# EAGLE design MakePython NRF52840 V1.1 (EAGLE 6.1)
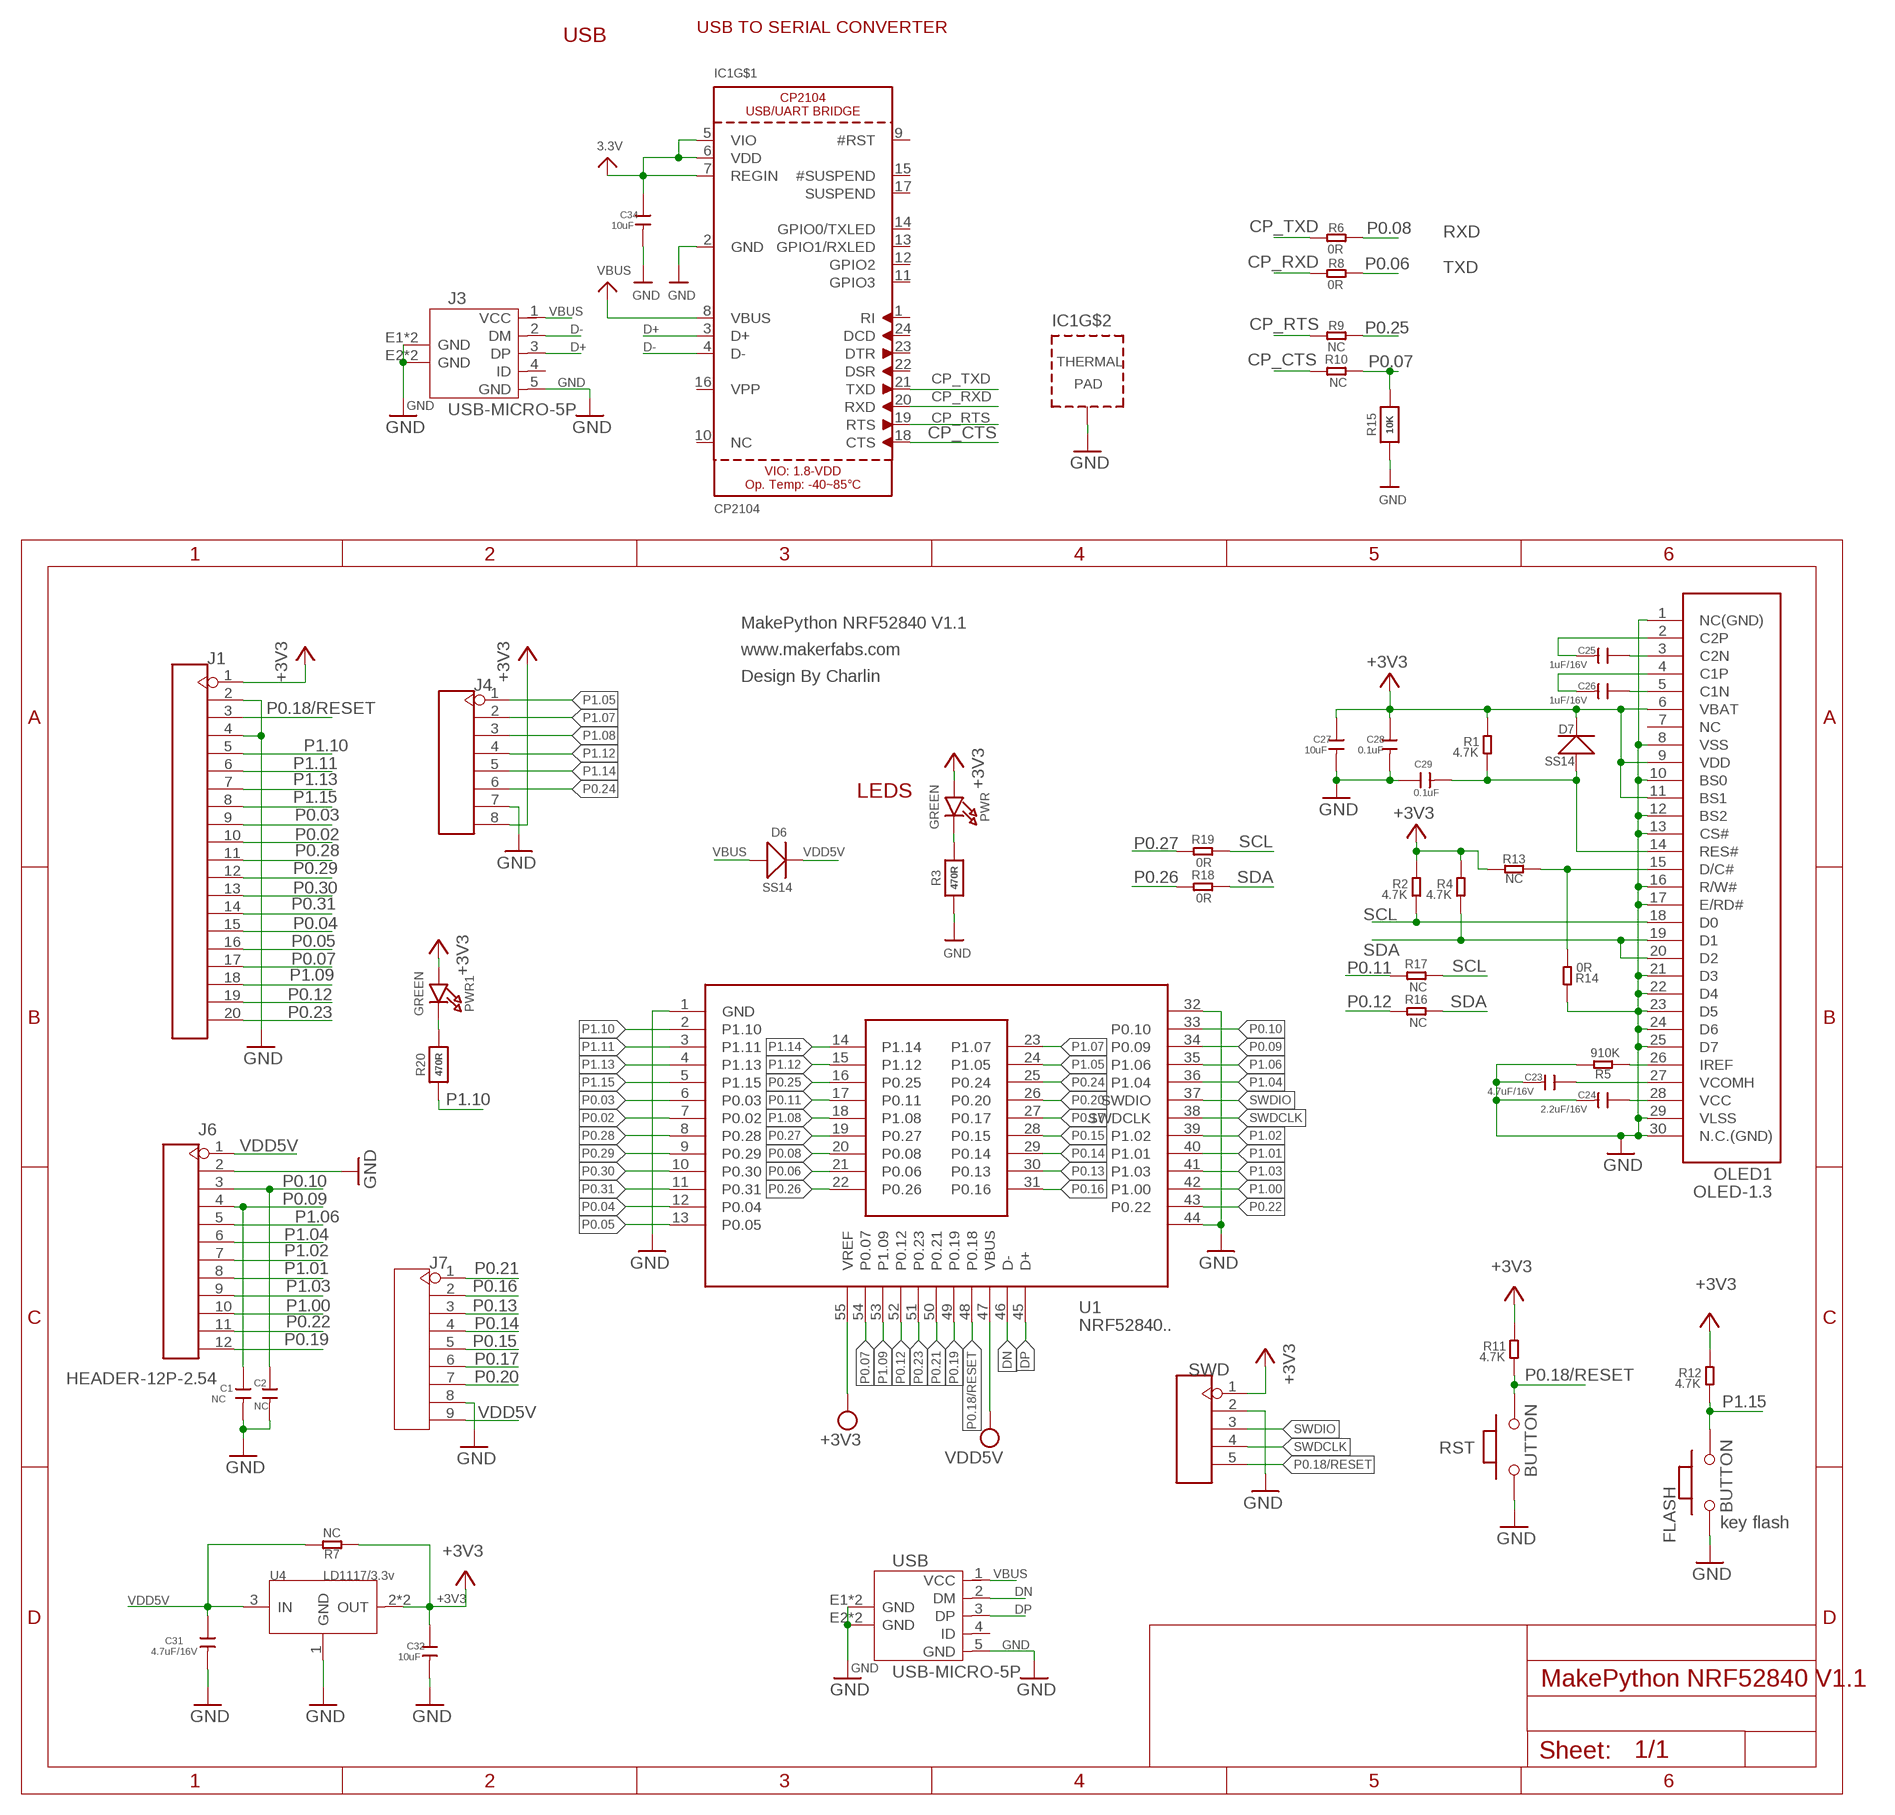
[diagram p0: schematic, sheet 1]

## Parts
C1  NC  C-0603  [C0603]
C2  NC  C-0603  [C0603]
C23  4.7uF/16V  C-0603  [C0603]
C24  2.2uF/16V  C-0603  [C0603]
C25  1uF/16V  C-0603  [C0603]
C26  1uF/16V  C-0603  [C0603]
C27  10uF  C-0603  [C0603]
C28  0.1uF  C-0603  [C0603]
C29  0.1uF  C-0603  [C0603]
C31  4.7uF/16V  C-0603  [C0603]
C32  10uF  C-0603  [C0603]
C34  10uF  C-0603  [C0603]
D6  SS14  D'0805'  [SOD323]
D7  SS14  D'0805'  [SOD323]
FLASH  BUTTON  PB157  [157SW]
IC1  CP2104  [QFN24_4MM_SMSC]
J1  HEADER-20P-2.54  [20P-2.54]
J3  USB-MICRO-5P  [MICRO-USB-5P]
J4  HEADER-8P-2.54  [8P-2.54]
J6  HEADER-12P-2.54  [12P-2.54]
J7  HEADER-9P-2.54  [9P-2.54]
OLED1  OLED-1.3  [OLED-1.3]
PWR  GREEN  LED0805_NOOUTLINE  [CHIPLED_0805_NOOUTLINE]
PWR1  GREEN  LED0805_NOOUTLINE  [CHIPLED_0805_NOOUTLINE]
R1  4.7K  R-0603  [0603]
R2  4.7K  R-0603  [0603]
R3  470R  RESISTOR_0603_NOOUT  [0603-NO]
R4  4.7K  R-0603  [0603]
R5  910K  R-0603  [0603]
R6  0R  R-0603  [0603]
R7  NC  R-0603  [0603]
R8  0R  R-0603  [0603]
R9  NC  R-0603  [0603]
R10  NC  R-0603  [0603]
R11  4.7K  R-0603  [0603]
R12  4.7K  R-0603  [0603]
R13  NC  R-0603  [0603]
R14  0R  R-0603  [0603]
R15  10K  RESISTOR_0603_NOOUT  [0603-NO]
R16  NC  R-0603  [0603]
R17  NC  R-0603  [0603]
R18  0R  R-0603  [0603]
R19  0R  R-0603  [0603]
R20  470R  RESISTOR_0603_NOOUT  [0603-NO]
RST  BUTTON  PB157  [157SW]
SWD  HEADER-5P-2.54  [5P-2.54]
U1  NRF52840..  [NRF52840..]
U4  LD1117/3.3v  LD1117'SOT89'  [SOT89]
USB  USB-MICRO-5P  [MICRO-USB-5P]

## Nets
+3V3: C27.1 C28.1 C32.1 C34.1 D7.- IC1.5(VIO) IC1.6(VDD) IC1.7(REGIN) J1.1 J4.8 OLED1.6(VBAT) OLED1.9(VDD) OLED1.11(BS1) PWR1.A PWR.A R1.2 R2.2 R4.2 R7.2 R11.2 R12.2 R13.2 SWD.1 U1.55(VREF) U4.2(OUT) U4.4(OUT) ; supply symbol labelled 3.3V
CP_CTS: IC1.18(CTS) R10.2
CP_RTS: IC1.19(RTS) R9.2
CP_RXD: IC1.20(RXD) R8.2
CP_TXD: IC1.21(TXD) R6.2
D+: IC1.3(D+) J3.3(DP)
D-: IC1.4(D-) J3.2(DM)
DN: U1.46(D-) USB.2(DM)
DP: U1.45(D+) USB.3(DP)
GND: C1.2 C2.2 C23.2 C24.2 C27.2 C28.2 C29.1 C31.2 C32.2 C34.2 FLASH.1 IC1.2(GND) IC1.THERM(TP) J1.2 J1.4 J3.5(GND) J3.E1(GND) J3.E2(GND) J3.P1(GND) J3.P2(GND) J4.7 J6.2 J7.8 OLED1.1(NC(GND)) OLED1.8(VSS) OLED1.10(BS0) OLED1.12(BS2) OLED1.13(CS#) OLED1.16(R/W#) OLED1.17(E/RD#) OLED1.21(D3) OLED1.22(D4) OLED1.23(D5) OLED1.24(D6) OLED1.25(D7) OLED1.29(VLSS) OLED1.30(N.C.(GND)) R3.1 R5.2 R14.2 R15.1 RST.1 SWD.2 U1.1(GND) U1.32 U1.44 U4.1(GND) USB.5(GND) USB.E1(GND) USB.E2(GND) USB.P1(GND) USB.P2(GND)
N$1: PWR1.C R20.2
N$3: OLED1.15(D/C#) R13.1 R14.1
N$5: PWR.C R3.2
N$16: C25.1 OLED1.3(C2N)
N$17: C25.2 OLED1.2(C2P)
N$18: C26.1 OLED1.5(C1N)
N$19: C26.2 OLED1.4(C1P)
N$20: C29.2 D7.+ OLED1.14(RES#) R1.1
N$24: OLED1.26(IREF) R5.1
N$25: C24.1 OLED1.28(VCC)
N$26: C23.1 OLED1.27(VCOMH)
P0.02: J1.10 U1.7(P0.02)
P0.03: J1.9 U1.6(P0.03)
P0.04: J1.15 U1.12(P0.04)
P0.05: J1.16 U1.13(P0.05)
P0.06: R8.1 U1.21(P0.06)
P0.07: J1.17 R10.1 R15.2 U1.54(P0.07)
P0.08: R6.1 U1.20(P0.08)
P0.09: C1.1 J6.4 U1.34(P0.09)
P0.10: C2.1 J6.3 U1.33(P0.10)
P0.11: R17.2 U1.17(P0.11)
P0.12: J1.19 R16.2 U1.52(P0.12)
P0.13: J7.3 U1.30(P0.13)
P0.14: J7.4 U1.29(P0.14)
P0.15: J7.5 U1.28(P0.15)
P0.16: J7.2 U1.31(P0.16)
P0.17: J7.6 U1.27(P0.17)
P0.18/RESET: J1.3 R11.1 RST.2 SWD.5 U1.48(P0.18)
P0.19: J6.12 U1.49(P0.19)
P0.20: J7.7 U1.26(P0.20)
P0.21: J7.1 U1.50(P0.21)
P0.22: J6.11 U1.43(P0.22)
P0.23: J1.20 U1.51(P0.23)
P0.24: J4.6 U1.25(P0.24)
P0.25: R9.1 U1.16(P0.25)
P0.26: R18.2 U1.22(P0.26)
P0.27: R19.2 U1.19(P0.27)
P0.28: J1.11 U1.8(P0.28)
P0.29: J1.12 U1.9(P0.29)
P0.30: J1.13 U1.10(P0.30)
P0.31: J1.14 U1.11(P0.31)
P1.00: J6.10 U1.42(P1.00)
P1.01: J6.8 U1.40(P1.01)
P1.02: J6.7 U1.39(P1.02)
P1.03: J6.9 U1.41(P1.03)
P1.04: J6.6 U1.36(P1.04)
P1.05: J4.1 U1.24(P1.05)
P1.06: J6.5 U1.35(P1.06)
P1.07: J4.2 U1.23(P1.07)
P1.08: J4.3 U1.18(P1.08)
P1.09: J1.18 U1.53(P1.09)
P1.10: J1.5 R20.1 U1.2(P1.10)
P1.11: J1.6 U1.3(P1.11)
P1.12: J4.4 U1.15(P1.12)
P1.13: J1.7 U1.4(P1.13)
P1.14: J4.5 U1.14(P1.14)
P1.15: FLASH.2 J1.8 R12.1 U1.5(P1.15)
SCL: OLED1.18(D0) R2.1 R17.1 R19.1
SDA: OLED1.19(D1) OLED1.20(D2) R4.1 R16.1 R18.1
SWDCLK: SWD.4 U1.38(SWDCLK)
SWDIO: SWD.3 U1.37(SWDIO)
VBUS: D6.+ IC1.8(VBUS) J3.1(VCC) USB.1(VCC)
VDD5V: C31.1 D6.- J6.1 J7.9 R7.1 U1.47(VBUS) U4.3(IN)
Unconnected: IC1.1(RI) IC1.9(#RST) IC1.10(NC) IC1.11(GPIO3) IC1.12(GPIO2) IC1.13(GPIO1/RXLED) IC1.14(GPIO0/TXLED) IC1.15(#SUSPEND) IC1.16(VPP) IC1.17(SUSPEND) IC1.22(DSR) IC1.23(DTR) IC1.24(DCD) J3.4(ID) OLED1.7(NC) USB.4(ID)

## Notes on the sheet
- USB TO SERIAL CONVERTER
- USB
- RXD
- TXD
- MakePython NRF52840 V1.1
- www.makerfabs.com
- Design By Charlin
- LEDS
- key flash

## Library data of the parts
C1 C2 C23-C29 C31 C32 C34 = Discrete:C*: Ceramic Capacitors
D6 D7 = Discrete:D*
FLASH RST = MySMD:PB157
IC1 = microbuilder:CP2104: CP2104 - USB to UART Bridge VDD Output: 3.45V
J1 = Connector:HEADER-20P
J3 USB = Connector:USB-MICRO-5P
J4 = Connector:HEADER-8P
J6 = Connector:HEADER-12P
J7 = Connector:HEADER-9P
OLED1 = OLED:OLED-1.3
PWR PWR1 = microbuilder:LED: LED 0603 - 0603 Surface Mount Package 2mA: Green LED - Low Power (3.9mcd, 2ma, 1.7Vf) - Digikey: 475-2709-2-ND Orange LED - Low Power (9.8mcd, 2ma, 1.8Vf) - Digikey: 475-1194-2-ND Red LED - Low Power (5mcd, 2ma, 1.8Vf) - Digikey: 475-1195-2-ND Yellow LED - Low Power (7mcd, 2ma, 1.8Vf) - Digikey: 475-1196-2-ND 5mA: Blue LED - Low Power (17mcd, 5ma, 2.9Vf) - Digikey: LNJ937W8CRACT-ND 0805 - 0805 Surface Mount Package 2mA: Red LED (8.8mcd, 2mA, 1.8Vf, Clear) - Low Power [Digikey: 475-2510-1-ND] Green LED (5mcd, 2mA, 1.8Vf, Clear) - Low Power [Digikey: 475-2730-1-ND] Yellow LED (11.3mcd, 2mA, 1.8Vf, Clear) - Low Power [Digikey: 475-2555-1-ND] 20mA: Red LED (104mcd, 20mA, Diffused) - LS R976 [Digikey: 475-1278-6-ND] Red LED (12mcd, 20mA, 2.0Vf, Clear) - APT2012EC [Digikey: 754-1128-1-ND] Green LED (15mcd, 20mA, 2.2Vf, Clear) - APT2012GC [Digikey: 754-1131-1-ND] Orange LED (160mcd, 20mA, 2.1Vf, Clear) - APT2012SECK [Digikey: 754-1130-1-ND] 1206 - 1206 Surface Mount Package Green LED (26mcd, 20mA, Diffused) - LG N971 [Digikey: 475-1407-6-ND] Red LED (15mcd, 20mA, Diffused) - LH N974 [Digikey: 475-1416-6-ND] Cree - Cree High-Power Surface Mount LEDs XPEBWT-L1-0000-00D50 - White 111lm 350mA 2.9Vf 6200K 110° XTEAWT-00-0000-00000LEE3 - White 114lm 350mA 2.85Vf 5000K 115° Everlight - Everlight 45-21 Series Surface Mount LEDs 45-21/QK2C-B2832AC2CB2/2T - Warm White 2000mcd 20mA 3.25Vf 3050K 120° 45-21/LK2C-B38452C4CB2/2T - Nuetral White 2000mcd 20mA 3.25Vf 4150K 120° 45-21/LK2C-B50634C6CB2/2T - Cold White 2200mcd 20mA 3.25Vf 5650K 120° PLCC2 Reverse Mount LS T77K-J1L2-1-0-2-R18-Z - Red 11.25mcd 2mA 1.8Vf 630nm 120° LO T77K-L1M2-24-Z - Orange 19.6mcd 2mA 1.8Vf 606nm 120° LY T77K-K2M1-26-Z - Yellow 15.7mcd 2mA 1.8Vf 587nm 120°
R1 R2 R4-R14 R16-R19 = Discrete:R*
R3 R15 R20 = microbuilder:RESISTOR: Resistors For new designs, use the packages preceded by an '_' character since they are more reliable: The following footprints should be used on most boards: _0402 - Standard footprint for regular board layouts _0603 - Standard footprint for regular board layouts _0805 - Standard footprint for regular board layouts _1206 - Standard footprint for regular board layouts For extremely tight-pitch boards where space is at a premium, the following 'micro-pitch' footprints can be used (smaller pads, no silkscreen outline, etc.): _0402MP - Micro-pitch footprint for very dense/compact boards _0603MP - Micro-pitch footprint for very dense/compact boards _0805MP - Micro-pitch footprint for very dense/compact boards _1206MP - Micro-pitch footprint for very dense/compact boards
SWD = Connector:HEADER-5P
U1 = NRF52840:NRF52840..
U4 = IC:LD1117: Low Drop Fixed And Adjustable Positive Voltage Regulators http://www.datasheetcatalog.org/datasheet/SGSThomsonMicroelectronics/mXuqtqv.pdf

## Net classes
0 default: width 0.254 mm, drill 0.305 mm, clearance 0.152 mm
1 vbat: width 0.254 mm, drill 0.305 mm, clearance 0.152 mm

## Board
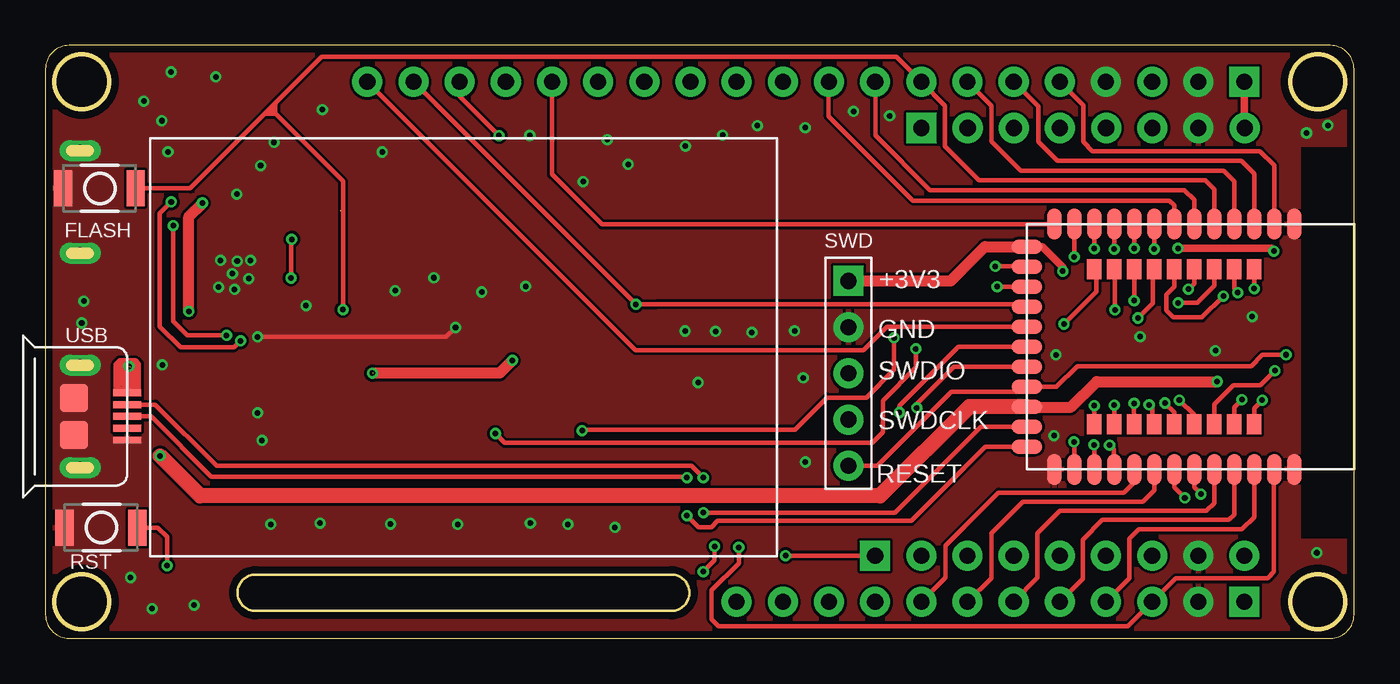
[diagram p1: board, top side]
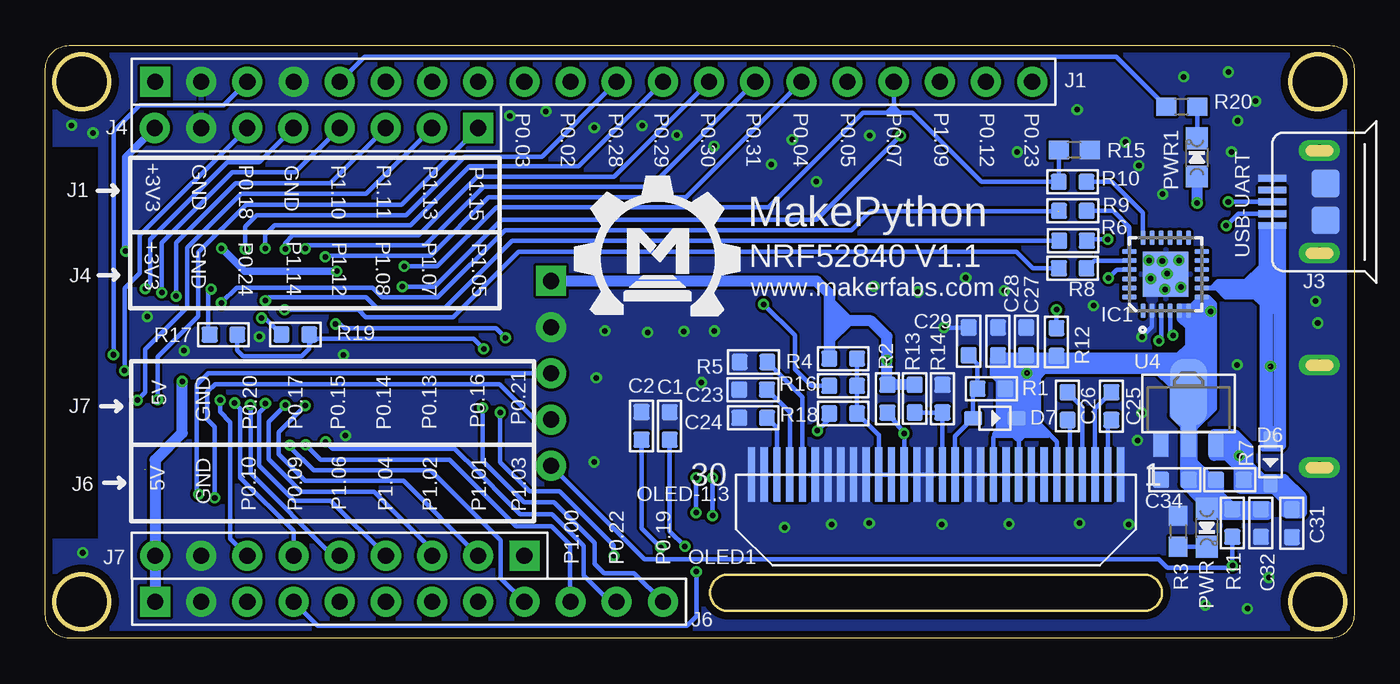
[diagram p2: board, bottom side, seen from below]

Size 72 x 32.6 mm. Coordinates in mm from the lower left corner, seen from the top.
Outline: 72,1.3 72,31.3 arc90 70.7,32.6 1.3,32.6 arc90 0,31.3 0,1.3 arc90 1.3,0 70.7,0 arc90 72,1.3
Outline: circle at 2,2 radius 1.5
Outline: circle at 2,30.6 radius 1.5
Outline: circle at 70,30.6 radius 1.5
Outline: circle at 70,2 radius 1.5
Copper layers (1*16): Top 0.035mm / dielectric 0.2mm / Bottom 0.035mm
Design rules: minimum track width 0.15mm, minimum drill 0.4mm, track to track 0.15mm, track to pad 0.15mm, pad to pad 0.15mm, via to via 0.15mm, smd to smd 0.15mm, copper to edge 0.4mm, drill to drill 0.4mm, minimum pad ring 3mil, minimum via ring 3mil, stop-mask expansion 4mil, vias tented up to drill 100mil, thermal gap 0mil
tRestrict: area 69.1,5.5 to 71.9,27
bRestrict: area 69.1,5.5 to 71.9,27

### Footprints (pad centres in the part's own frame; a part is rotated, then mirrored left to right if it is on the bottom)
C0603 = smd 0.889 x 0.889: 1 -0.762,0; 2 0.762,0
SOD323 = smd 1 x 0.8: + -1.2,0; - 1.2,0
157SW = smd 1.016 x 1.981: 1 0,0; 2 4,0
QFN24_4MM_SMSC = smd 0.8 x 0.28: 1 -2,1.25; 2 -2,0.75; 3 -2,0.25; 4 -2,-0.25; 5 -2,-0.75; 6 -2,-1.25; 13 2,-1.25; 14 2,-0.75; 15 2,-0.25; 16 2,0.25; 17 2,0.75; 18 2,1.25 | smd 0.28 x 0.8: 7 -1.25,-2; 8 -0.75,-2; 9 -0.25,-2; 10 0.25,-2; 11 0.75,-2; 12 1.25,-2; 19 1.25,2; 20 0.75,2; 21 0.25,2; 22 -0.25,2; 23 -0.75,2; 24 -1.25,2 | smd 2.5 x 2.5: THERM 0,0
20P-2.54 = drill 0.889 pad 1.651 square: 1 -25.4,0 | drill 0.889 pad 1.651: 2 -22.86,0; 3 -20.32,0; 4 -17.78,0; 5 -15.24,0; 6 -12.7,0; 7 -10.16,0; 8 -7.62,0; 9 -5.08,0; 10 -2.54,0; 11 0,0; 12 2.54,0; 13 5.08,0; 14 7.62,0; 15 10.16,0; 16 12.7,0; 17 15.24,0; 18 17.78,0; 19 20.32,0; 20 22.86,0
MICRO-USB-5P = smd 0.38 x 1.52: 1 -1.3,0; 2 -0.65,0; 3 0,0; 4 0.65,0; 5 1.3,0 | smd 1.524 x 1.524: E1 -1.016,-2.921; E2 1.016,-2.921 | drill 0.635 pad 1.143 long: P1 -2.819,-2.591; P2 2.819,-2.591
8P-2.54 = drill 0.889 pad 1.651 square: 1 0,8.89 | drill 0.889 pad 1.651: 2 0,6.35; 3 0,3.81; 4 0,1.27; 5 0,-1.27; 6 0,-3.81; 7 0,-6.35; 8 0,-8.89
12P-2.54 = drill 0.889 pad 1.651 square: 1 0,13.97 | drill 0.889 pad 1.651: 2 0,11.43; 3 0,8.89; 4 0,6.35; 5 0,3.81; 6 0,1.27; 7 0,-1.27; 8 0,-3.81; 9 0,-6.35; 10 0,-8.89; 11 0,-11.43; 12 0,-13.97
9P-2.54 = drill 0.889 pad 1.651 square: 1 0,10.16 | drill 0.889 pad 1.651: 2 0,7.62; 3 0,5.08; 4 0,2.54; 5 0,0; 6 0,-2.54; 7 0,-5.08; 8 0,-7.62; 9 0,-10.16
OLED-1.3 = smd 0.4 x 3 bottom: 1 -10.15,-7; 2 -9.45,-7; 3 -8.75,-7; 4 -8.05,-7; 5 -7.35,-7; 6 -6.65,-7; 7 -5.95,-7; 8 -5.25,-7; 9 -4.55,-7; 10 -3.85,-7; 11 -3.15,-7; 12 -2.45,-7; 13 -1.75,-7; 14 -1.05,-7; 15 -0.35,-7; 16 0.35,-7; 17 1.05,-7; 18 1.75,-7; 19 2.45,-7; 20 3.15,-7; 21 3.85,-7; 22 4.55,-7; 23 5.25,-7; 24 5.95,-7; 25 6.65,-7; 26 7.35,-7; 27 8.05,-7; 28 8.75,-7; 29 9.45,-7; 30 10.15,-7
CHIPLED_0805_NOOUTLINE = smd 1.2 x 1.2: A 0,-1.05; C 0,1.05
0603 = smd 0.889 x 0.889: 1 -0.762,0; 2 0.762,0
0603-NO = smd 1.1 x 1: 1 -0.85,0; 2 0.85,0
5P-2.54 = drill 0.889 pad 1.651 square: 1 0,5.08 | drill 0.889 pad 1.651: 2 0,2.54; 3 0,0; 4 0,-2.54; 5 0,-5.08
NRF52840.. = smd 1.7 x 0.8: 1 -6.75,5.7; 2 -6.75,4.6; 3 -6.75,3.5; 4 -6.75,2.4; 5 -6.75,1.3; 6 -6.75,0.2; 7 -6.75,-0.9; 8 -6.75,-2; 9 -6.75,-3.1; 10 -6.75,-4.2; 11 -6.75,-5.3; 12 -6.75,-6.4; 13 -6.75,-7.5; 32 6.75,5.7; 33 6.75,4.6; 34 6.75,3.5; 35 6.75,2.4; 36 6.75,1.3; 37 6.75,0.2; 38 6.75,-0.9; 39 6.75,-2; 40 6.75,-3.1; 41 6.75,-4.2; 42 6.75,-5.3; 43 6.75,-6.4; 44 6.75,-7.5 | smd 1.1 x 0.8: 14 -4.25,3.5; 15 -4.25,2.4; 16 -4.25,1.3; 17 -4.25,0.2; 18 -4.25,-0.9; 19 -4.25,-2; 20 -4.25,-3.1; 21 -4.25,-4.2; 22 -4.25,-5.3; 23 4.25,3.5; 24 4.25,2.4; 25 4.25,1.3; 26 4.25,0.2; 27 4.25,-0.9; 28 4.25,-2; 29 4.25,-3.1; 30 4.25,-4.2; 31 4.25,-5.3 | smd 0.8 x 1.7: 45 5.5,-9; 46 4.4,-9; 47 3.3,-9; 48 2.2,-9; 49 1.1,-9; 50 0,-9; 51 -1.1,-9; 52 -2.2,-9; 53 -3.3,-9; 54 -4.4,-9; 55 -5.5,-9
SOT89 = smd 0.8 x 1.4: 1 -1.524,-1.905; 3 1.524,-1.905 | smd 0.8 x 1.9: 2 0,-1.651 | smd 2.032 x 3.65: 4 0,0.94

### Placement (x,y rotation side)
C1  37.66,11.67 90 bottom
C2  39.2,11.67 90 bottom
C23  33.07,13.67 180 bottom
C24  33.06,12.12 180 bottom
C25  13.36,12.76 270 bottom
C26  15.76,12.77 90 bottom
C27  18.04,16.33 90 bottom
C28  19.59,16.32 90 bottom
C29  21.2,16.32 270 bottom
C31  3.42,6.32 270 bottom
C32  5.12,6.33 270 bottom
C34  9.85,8.71 180 bottom
D6  4.6,9.7 270 bottom
D7  19.77,12.1 0 bottom
FLASH  0.97,24.74 0 top
IC1  10.36,20.02 90 bottom
J1  40.57,30.6 0 bottom
J3  4.5,24 90 bottom
J4  57.09,28.06 270 bottom
J6  52,2 90 bottom
J7  55.81,4.54 270 bottom
OLED1  23,16 0 top
PWR  8.1,6.07 180 bottom
PWR1  8.64,26.44 0 bottom
R1  19.96,13.72 0 bottom
R2  25.68,13.17 90 bottom
R3  9.69,5.88 270 bottom
R4  28.11,15.37 180 bottom
R5  33.04,15.19 180 bottom
R6  15.46,21.86 0 bottom
R7  6.83,8.71 180 bottom
R8  15.48,20.35 0 bottom
R9  15.47,23.51 0 bottom
R10  15.49,25.1 0 bottom
R11  6.7,6.33 90 bottom
R12  16.37,16.29 270 bottom
R13  24.18,13.18 90 bottom
R14  22.65,13.17 90 bottom
R15  15.4,26.85 180 bottom
R16  28.11,13.87 180 bottom
R17  62.2,16.7 180 bottom
R18  28.11,12.36 180 bottom
R19  58.25,16.7 180 bottom
R20  9.48,29.23 0 bottom
RST  1.06,6.08 0 top
SWD  44.18,14.57 0 top
U1  63,16.03 270 top
U4  9.11,12.59 0 bottom
U$1  [MAKERFABS_0.3]  42.43,17.79 0 bottom
USB  4.5,12.2 270 top

### Tracks (layer width: path | path; a pad name or v marks a point on that pad's centre or on a via)
+3V3  (via drill 0.3 pad 0.61)  (1 unrouted)
  Top 0.406: U1.55 54.84,21.53 55.97,20.4 v55.97,20.18 | J4.8 J1.1 | v62.31,21.44 67.44,21.44 v67.59,21.29
  Top 0.61: v18,14.57 24.99,14.57 v25.7,15.28 | SWD.1 49.81,19.65 51.69,21.53 U1.55 | v7.89,17.98 7.89,23.18 v8.64,23.93
  Bottom 0.254: U4.2 U4.4 9.11,17.13 IC1.6 | C32.1 R11.2 8.08,7.09 PWR.A 8.1,8.5 8.31,8.71 C34.1 | C34.1 | U4.2 9.11,8.72 C34.1 | IC1.6 9.11,17.14 8.59,17.14 8.36,17.36 IC1.7 8.36,18.75 7.89,18.29 v7.89,17.98 | IC1.6 IC1.5 | OLED1.6 16.35,10.82 17.63,12.09 18.82,12.09 D7.- | OLED1.9 18.45,11.73 D7.- | OLED1.11 19.85,11.06 D7.- | D7.- 19.2,12.47 R1.2 19.2,14.58 | C27.1 C28.1 19.2,15.17 19.2,14.58 | U4.2 9.11,15.5 9.1,15.5 17.98,15.5 C27.1 | R12.2 18,15.53 C27.1 | v18,14.57 19.19,14.57 19.2,14.58 | R2.2 25.69,13.95 | v8.64,23.94 v8.64,23.93 | J4.8
  Bottom 0.406: v55.97,20.18 61.05,20.18 v62.31,21.44 | 7.91,18.43 7.91,18.54 8.09,18.71 8.42,18.71 8.98,18.16 8.99,18.16 9.04,18.21 9.55,18.21 9.55,17.57 9.1,17.12 9.1,16.07 9.66,15.52 19.68,15.52 19.84,15.37 19.84,14.51 19.5,14.18 19.5,11.42 19.72,11.21 16.86,11.21 17.43,11.78 17.43,14.37 17.05,14.74 10.84,14.74 9.95,13.85 9.95,12.26 9.37,11.68 9.37,8.46 8.5,7.59 8.5,6.73 8.48,6.71 4.74,6.71 4.74,7.33 6.75,7.33 7.35,7.93 7.35,8.95 8.05,8.95 8.81,9.71 8.81,11.6 7.75,12.66 7.75,18.38 8.01,18.63 8.01,12.69 8.13,12.56 8.13,14.83 8.36,15.05 8.36,18.33 8.3,18.38 8.42,18.38 8.98,17.82 9.18,17.82 9.29,17.7 8.72,17.7 8.57,17.85 8.57,15.47 8.7,15.34 8.88,15.34 8.91,15.36 8.91,17.58 8.79,17.69 8.79,16.01 9.49,15.31 19.24,15.31 19.56,14.98 19.56,14.65 19.03,14.12 | 19.03,11.65 19.27,11.41 18.91,11.41 18.52,11.02 18.4,11.02 18.2,11.22 17.74,11.22 17.46,11.5 18.92,11.5 17.94,11.5 17.63,11.81 18.36,11.81 18.43,11.74 18.43,12.26 18.72,12.56 18.72,14.31 19.27,14.85 19.18,14.85 18.97,15.06 18.91,15.06 18.27,14.42 18.27,12.26 18.24,12.23 17.74,12.23 17.71,12.26 17.71,14.97 17.75,15.01 18.56,15.01 18.59,14.97 18.59,12.74 18.51,12.66 18.18,12.66 17.99,12.47 17.99,14.59 18.2,14.8 17.49,14.8 17.44,14.75 17.44,14.98 17.4,15.02 10.71,15.02 10.01,14.31 10.01,15.06 10.03,15.08 10.52,15.08 10.54,15.07 10.48,15.07 10.14,14.73 9.65,14.73 9.05,14.12 9.05,9.5 8.5,8.96 8.31,8.77 8.31,8.66 8.79,8.18 8.77,8.18 7.53,6.94 5.59,6.94 5.58,6.95 6.86,6.95 7.24,7.32 7.58,7.32 8.48,8.22 8.4,8.22 8.18,8.45 8.02,8.45 7.57,8 7.57,7.76 7.3,7.49 7.47,7.49 8.13,8.14
  Bottom 0.406: v67.59,21.29 67.59,26.45 J4.8
  Bottom 0.61: R13.2 R2.2 | 25.69,13.95 v25.7,15.28 25.7,16.58 26.57,17.45 28.73,17.45 28.87,17.6 | R4.2 28.87,17.6 | PWR1.A v8.64,23.94 | R7.2 8.25,8.71 8.5,8.96 | 28.87,17.6 28.87,18.49 | SWD.1 44.17,19.64 29.57,19.64 28.87,18.94 28.87,18.49 | 27.82,17.46 27.85,17.46 28.87,18.49 | 28.87,18.49 | 28.87,18.49 28.87,18.79 | 28.87,18.49 28.87,15.67 28.86,15.66 28.86,16.43 27.83,17.46
  Bottom 0.8: 19.03,14.12 19.03,11.65
CP_CTS
  Bottom 0.254: IC1.18 11.61,23.39 13.32,25.1 R10.2
CP_RTS
  Bottom 0.254: IC1.19 12.36,22.61 13.26,23.5 R9.2
CP_RXD
  Bottom 0.254: IC1.20 14.3,20.77 R8.2
CP_TXD  (via drill 0.3 pad 0.61)
  Top 0.254: v13.51,19.81 13.51,21.9 v13.56,21.94
  Bottom 0.254: IC1.21 13.05,20.27 v13.51,19.81 | v13.56,21.94 14.62,21.94 R6.2
D+  (via drill 0.3 pad 0.61)
  Top 0.254: v10.73,16.36 10.37,16 7.44,16 6.3,17.14 6.3,23.38 v6.92,24
  Bottom 0.254: IC1.3 10.61,16.48 v10.73,16.36 | J3.3 v6.92,24
D-  (via drill 0.3 pad 0.61)
  Top 0.254: 9.73,16.65 v9.96,16.65 7.8,16.65 7.03,17.42 v7.03,22.69 | 9.73,16.65
  Bottom 0.254: IC1.4 10.11,16.8 v9.96,16.65 | J3.2 6.37,23.35 v7.03,22.69
DN  (via drill 0.3 pad 0.61)
  Top 0.254: U1.46 51.48,11.63 46.75,6.9 v36.2,6.9 | USB.2 6.05,12.85 9.41,9.48 35.55,9.48 v36.19,8.84
  Bottom 0.254: v36.2,6.9 36.19,6.91 v36.19,8.84
DP  (via drill 0.3 pad 0.61)
  Top 0.254: U1.45 51.71,10.53 47.63,6.46 36.99,6.46 36.63,6.1 35.93,6.1 v35.3,6.74 | v35.29,8.83 35.23,8.89 9.13,8.89 5.82,12.2 USB.3
  Bottom 0.254: v35.3,6.74 v35.29,6.74 v35.29,8.83
GND  (via drill 0.3 pad 0.61)
  Top 0.254: v11.67,16.57 22.05,16.57 v22.57,17.09
  Bottom 0.254: OLED1.16 OLED1.17 | IC1.2 11.11,17.13 v11.67,16.57 | v22.57,17.09 C29.1
  other vias: 9.64,20.78 10.55,20.73 11.28,20.78 11.19,19.78 10.29,20.05 9.53,19.31 10.41,19.18 6.74,26.74 6.43,15.04 6.4,28.46 2.12,18.54 10.52,24.42 11.84,25.99 4.68,3.34 5.87,1.62 8.18,1.82 5.42,29.54 6.91,31.14 9.38,30.87 15.24,29.07 18.53,26.74 14.34,18.29 11.67,12.39 11.92,10.88 21.37,19.82 32.06,26.06 35.2,16.9 38.86,16.82 36.87,16.88 41.81,9.69 31.33,6.09 26.68,6.33 22.69,6.26 18.98,6.28 15.11,6.33 12.4,6.26 69.95,4.7 69.38,27.78 70.56,28.2 41.69,14.31 41.21,16.91 28.75,6.26 12.57,27.28 66.4,17.68 64.37,15.82 55.6,15.58 29.58,25.11 26.65,27.65 60.23,16.59 2,17.33 24,19.04 19.24,19.11 26.42,19.35 35.91,14.06 30.91,27.42 35.21,27.07 37.26,27.66 39.17,28.19 41.8,28.08 44.46,28.97 46.45,28.73 55.49,11.14
  pour Top: -8.7,-5.7 -8.9,49.1 97.2,49 97.4,-5.8
  pour Bottom: -8.4,-5.3 -9.6,49.5 96.9,49 98.1,-5.8
N$1
  Bottom 0.254: PWR1.C 8.63,27.5 R20.2
N$3
  Bottom 0.254: OLED1.15 R14.1 R13.1
N$5
  Bottom 0.254: PWR.C R3.2
N$16
  Bottom 0.254: OLED1.3 14.25,12.63 C25.1
N$17
  Bottom 0.254: OLED1.2 13.55,11.81 C25.2
N$18
  Bottom 0.254: OLED1.5 15.65,11.89 C26.1
N$19
  Bottom 0.254: OLED1.4 14.95,12.71 C26.2
N$20
  Bottom 0.254: C29.2 20.72,15.08 R1.1 20.97,13.47 D7.+ 21.95,11.11 OLED1.14
N$24
  Bottom 0.254: OLED1.26 30.35,13.26 R5.1
N$25
  Bottom 0.254: OLED1.28 31.75,11.57 C24.1
N$26
  Bottom 0.254: OLED1.27 31.05,12.42 C23.1
P0.02
  Top 0.254: U1.7 62.1,23.8 61.84,24.06 47.74,24.06 43.09,28.7 43.09,30.59 J1.10
P0.03
  Top 0.254: U1.6 63.2,24.12 62.67,24.64 48.67,24.64 45.66,27.66 J1.9
P0.04  (via drill 0.3 pad 0.61)
  Top 0.254: U1.12 v56.6,20.97
  Bottom 0.254: v56.6,20.97 56.53,21.05 50.82,21.05 47.61,24.25 36.76,24.25 J1.15
P0.05
  Top 0.254: U1.13 55.48,22.76 30.61,22.76 27.87,25.5 J1.16
P0.06  (via drill 0.3 pad 0.61)
  Top 0.254: U1.21 58.84,20.24 v58.84,18.06
  Bottom 0.254: R8.1 17.67,20.35 18.57,21.25 45.98,21.25 49.56,17.66 54.38,17.66 54.78,18.06 v58.84,18.06
P0.07  (via drill 0.3 pad 0.61)
  Top 0.254: v52.26,20.45 53.98,20.45 U1.54
  Bottom 0.254: v52.26,20.45 50.44,20.45 47.19,23.7 32.23,23.7 27.03,28.9 25.36,28.9 | 25.36,28.9 24.3,28.9 20.5,25.1 R10.1 R15.2 | J1.17 25.33,28.93 | 25.33,28.93 25.36,28.9 | 25.33,29.42 25.33,29.27 | 25.33,29.27 | 25.33,29.27 25.65,28.95 25.33,29.27 | 25.33,29.27 25.33,29.23 25.17,29.07 | 25.17,29.07 25.01,28.91 | 25.33,28.93 25.19,29.07 25.17,29.07
P0.08  (via drill 0.3 pad 0.61)
  Top 0.254: U1.20 v59.9,18.57
  Bottom 0.254: R6.1 46.34,21.86 50.02,18.18 53.79,18.18 54.36,18.75 59.72,18.75 v59.9,18.57
P0.09  (via drill 0.3 pad 0.61)  (1 unrouted)
  Top 0.254: U1.34 66.5,6.65 65.83,5.98 60.15,5.98 59.65,5.47 59.65,3.3 J6.4 | v36.19,3.66 36.81,4.28 v36.81,5.04
  Bottom 0.254: J6.4 57.03,0.68 36.71,0.68 36.19,1.2 v36.19,3.66 | C1.1 37.66,5.89 v36.81,5.04
P0.10  (via drill 0.3 pad 0.61)
  Top 0.254: U1.33 67.59,3.65 67.24,3.29 62.18,3.29 J6.3 59.56,0.67 37.04,0.67 36.66,1.05 36.66,2.63 38.15,4.12 v38.15,5
  Bottom 0.254: C2.1 39.2,6.05 v38.15,5
P0.11  (via drill 0.3 pad 0.61)  (1 unrouted)
  Top 0.254: U1.17 63.2,19.51 v62.89,19.19
  Bottom 0.254: R17.2 62.89,16.78 63.03,16.93 63.03,19.05 v62.89,19.2
P0.12  (via drill 0.3 pad 0.61)
  Top 0.254: U1.52 53.87,18.36 33.59,18.36 v32.48,18.36 J1.19
  Bottom 0.254: R16.2 29.84,13.88 30.77,14.8 30.77,16.65 v32.48,18.36
P0.13  (via drill 0.3 pad 0.61)
  Top 0.254: v58.8,12.81 U1.30 | U1.30
  Bottom 0.254: v58.8,12.81 59.71,11.91 59.71,9.84 57.92,8.05 53.92,8.05 50.73,4.86 J7.3
P0.14  (via drill 0.3 pad 0.61)
  Top 0.254: v59.9,12.91 U1.29
  Bottom 0.254: v59.9,12.91 59.9,12.75 60.23,12.41 60.23,9.48 58.33,7.57 56.3,7.57 J7.4
P0.15  (via drill 0.3 pad 0.61)
  Top 0.254: U1.28 60.9,11.88 60.9,12.65 v60.72,12.83
  Bottom 0.254: v60.72,12.83 60.72,9.07 56.19,4.54 J7.5
P0.16  (via drill 0.3 pad 0.61)
  Top 0.254: v57.7,12.79 U1.31
  Bottom 0.254: v57.7,12.79 59.16,11.33 59.16,10.11 57.71,8.66 52.31,8.66 J7.2
P0.17  (via drill 0.3 pad 0.61)
  Top 0.254: U1.27 62.1,12.43 v61.59,12.94
  Bottom 0.254: v61.59,12.94 61.28,12.62 61.28,8.83 58.35,5.91 J7.6
P0.18/RESET  (via drill 0.3 pad 0.61)
  Top 0.254: SWD.5 45.79,9.48 49.86,13.56 53.73,13.56 U1.48 55.63,13.83 56.77,14.96 66.34,14.96 66.95,15.58 68.25,15.58 v68.26,15.59 | v6.69,3.99 v6.7,3.99 v6.7,4 R11.1 6.19,6.08 RST.2
  Bottom 0.254: R11.1 v6.7,4 v6.7,3.99 6.8,3.88 10.28,3.88 10.74,4.35 39.05,4.35 SWD.5 | v68.26,15.59 68.26,27.87 66.82,29.31 62.18,29.31 J1.3
P0.19  (via drill 0.3 pad 0.61)
  Top 0.254: U1.49 49.99,14.93 47.95,12.88 v47.95,12.67
  Bottom 0.254: v47.95,12.67 47.95,9.76 45.67,7.48 44.02,7.48 41.78,5.24 41.78,4.11 41.26,3.58 39.62,3.58 J6.12
P0.20  (via drill 0.3 pad 0.61)
  Top 0.254: v62.39,13.09 63.2,12.28 U1.26
  Bottom 0.254: v62.39,13.09 62.39,12.44 61.83,11.88 61.83,5.48 J7.7
P0.21  (via drill 0.3 pad 0.61)
  Top 0.254: U1.50 50.23,16.03 46.98,12.77 v46.98,12.41 | J7.1 v40.73,4.54 v40.72,4.54
  Bottom 0.254: v40.72,4.54 40.75,4.57 40.75,5.12 43.7,8.07 45.37,8.07 46.98,9.68 v46.98,12.41
P0.22  (via drill 0.3 pad 0.61)
  Top 0.254: U1.43 v56.6,10.79 v56.59,10.8
  Bottom 0.254: v56.59,10.8 56.21,10.41 49.49,10.41 48.85,9.77 48.84,9.77 45.89,6.82 44.12,6.82 42.39,5.1 42.39,3.46 40.94,2 J6.11
P0.23
  Top 0.254: U1.51 46.3,17.13 45.01,15.84 32.47,15.84 J1.20
P0.24  (via drill 0.3 pad 0.61)
  Top 0.254: U1.25 64.3,12.86 65.35,13.91 66.83,13.91 v67.64,14.72
  Bottom 0.254: v67.64,14.72 67.64,19.24 66.81,20.07 66.81,22.15 J4.6
P0.25  (via drill 0.3 pad 0.61)  (1 unrouted)
  Top 0.254: U1.16 64.3,19.38 63.37,18.44 v62.32,18.44 62.41,18.44
  Bottom 0.254: 16.28,23.48 26.6,23.48 27.64,22.44 46.72,22.44 50.41,18.75 53.48,18.75 54,19.27 61.49,19.27 v62.32,18.44
P0.26  (via drill 0.3 pad 0.61)
  Top 0.254: U1.22 57.81,20.17 57.81,19.04 v56.04,17.28 | v46.69,16.52 46.69,14.76 45.17,13.23 43,13.23 41.24,11.47 29.59,11.47 v29.54,11.41
  Bottom 0.254: v46.69,16.52 47.21,17.04 55.55,17.04 55.78,17.28 v56.04,17.28 | R18.2 28.87,12.08 v29.54,11.41
P0.27  (via drill 0.3 pad 0.61)
  Top 0.254: U1.19 60.92,20.2 60.92,18.42 v60.11,17.61
  Bottom 0.254: R19.2 59.92,17.61 v60.11,17.61
P0.28  (via drill 0.3 pad 0.61)
  Top 0.254: U1.8 | U1.8 v61,21.4
  Bottom 0.254: J1.11 44.69,26.48 48.94,26.48 52.17,23.25 60.38,23.25 61,22.63 v61,21.4
P0.29  (via drill 0.3 pad 0.61)
  Top 0.254: 59.9,21.56 v59.91,21.43 U1.9
  Bottom 0.254: J1.12 42.67,25.96 48.66,25.96 51.92,22.7 59.39,22.7 59.91,22.18 v59.91,21.43
P0.30  (via drill 0.3 pad 0.61)
  Top 0.254: 58.8,21.5 v58.81,21.4 U1.10
  Bottom 0.254: J1.13 40.71,25.38 48.25,25.38 51.48,22.15 58.39,22.15 58.81,21.73 v58.81,21.4
P0.31  (via drill 0.3 pad 0.61)
  Top 0.254: U1.11 v57.71,21.42
  Bottom 0.254: J1.14 38.72,24.83 47.9,24.83 51.12,21.61 57.63,21.61 57.71,21.53 v57.71,21.42
P1.00  (via drill 0.3 pad 0.61)
  Top 0.254: U1.42 v57.7,10.63 v57.69,10.63
  Bottom 0.254: v57.69,10.63 56.87,9.81 50.28,9.81 49.76,9.81 46.1,6.16 44.15,6.16 43.14,5.14 43.14,2.03 J6.10
P1.01
  Top 0.254: U1.40 59.9,8.56 59.34,8.01 52.45,8.01 49.52,5.08 49.52,3.33 J6.8
P1.02
  Top 0.254: U1.39 61,8.13 60.38,7.51 53.79,7.51 52.04,5.76 52.04,3.31 J6.7
P1.03  (via drill 0.3 pad 0.61)
  Top 0.254: U1.41 58.77,9.31 58.77,10.4 v58.55,10.62
  Bottom 0.254: J6.9 46.95,3.3 46.95,5.38 50.81,9.24 57.25,9.24 58.55,10.54 v58.55,10.62
P1.04
  Top 0.254: U1.36 64.3,7.43 63.87,7 55.81,7 54.58,5.77 54.58,3.31 J6.6
P1.05  (via drill 0.3 pad 0.61)
  Top 0.254: U1.24 65.4,12.69 v65.83,13.12
  Bottom 0.254: v65.83,13.12 65.83,15.48 63.6,17.71 63.6,21.22 60.97,23.85 52.41,23.85 J4.1
P1.06
  Top 0.254: U1.35 65.4,6.78 65.12,6.5 58.16,6.5 57.08,5.42 57.08,3.27 J6.5
P1.07  (via drill 0.3 pad 0.61)
  Top 0.254: U1.23 66.5,12.64 v66.95,13.09
  Bottom 0.254: v66.95,13.09 66.51,13.54 66.51,15.89 64.19,18.21 64.19,21.47 61.22,24.44 54.36,24.44 J4.2
P1.08  (via drill 0.3 pad 0.61)
  Top 0.254: 64.8,18.83 v64.81,18.81 63.64,17.64 62.04,17.64 61.66,18.03 61.66,18.89 62.1,19.33 U1.18
  Bottom 0.254: J4.3 56.3,25.04 56.3,25.03 61.54,25.03 64.81,21.76 v64.81,18.81
P1.09  (via drill 0.3 pad 0.61)
  Top 0.254: v52.36,19.33 U1.53 | v24.96,27.64 22.79,29.81 J1.18
  Bottom 0.254: v52.36,19.33 50.59,19.33 46.91,23.01 29.59,23.01 v24.96,27.64
P1.10
  Top 0.254: U1.2 67.6,26.01 66.81,26.79 57.61,26.79 57.09,27.3 57.09,29.32 J1.5
  Bottom 0.254: J1.5 54.44,31.97 13.07,31.97 R20.1
P1.11
  Top 0.254: U1.3 66.5,25.55 65.79,26.26 55.66,26.26 54.62,27.31 54.62,29.25 J1.6
P1.12  (via drill 0.3 pad 0.61)
  Top 0.254: U1.15 65.4,19.21 v65.6,19.01
  Bottom 0.254: J4.4 58.26,25.62 61.71,25.62 65.6,21.74 v65.6,19.01
P1.13
  Top 0.254: U1.4 65.4,25.13 64.82,25.71 53.68,25.71 52.05,27.34 52.05,29.29 J1.7
P1.14  (via drill 0.3 pad 0.61)
  Top 0.254: U1.14 v66.5,19.23
  Bottom 0.254: J4.5 60.24,26.18 62,26.18 66.25,21.93 66.25,19.48 v66.5,19.23
P1.15  (via drill 0.3 pad 0.61)
  Top 0.254: U1.5 64.3,24.7 63.8,25.2 51.37,25.2 49.5,27.07 49.5,29.29 J1.8 46.82,31.97 15.2,31.97 12.37,29.13 | 12.37,29.13 7.97,24.74 FLASH.2 | v16.37,18.07 16.37,25.13 12.37,29.13 | 12.07,28.84 12.65,28.84 12.65,29.12 | 12.65,29.12 12.65,29.42 12.69,29.46 | 12.37,29.13 12.64,29.13 12.65,29.12
  Bottom 0.254: R12.1 v16.37,18.07
SCL  (via drill 0.3 pad 0.61)
  Top 0.254: v24.76,11.26 25.27,10.74 45.49,10.74 46.07,11.32 46.07,13.07 47.89,14.89 v47.89,15.91
  Bottom 0.254: OLED1.18 24.75,11.29 R2.1 24.76,11.3 v24.76,11.26 | v47.89,15.91 48.45,16.47 57.21,16.47 57.48,16.19 | R17.1 61.44,15.84 61.11,15.51 57.9,15.51 57.48,15.93 57.48,16.19 | 57.48,16.19 R19.1
SDA
  Bottom 0.254: OLED1.19 OLED1.20 26.15,11.18 26.17,11.18 R18.1 R16.1 R4.1
SWDCLK  (via drill 0.3 pad 0.61)
  Top 0.254: U1.38 62.1,8.3 v62.69,7.71
  Bottom 0.254: v62.69,7.71 62.69,11.63 63.09,12.04 63.09,13.55 62.67,13.97 47.01,13.97 45.06,12.03 SWD.4
SWDIO  (via drill 0.3 pad 0.61)
  Top 0.254: U1.37 63.2,8.3 v63.58,7.92
  Bottom 0.254: v63.58,7.92 63.67,8.01 63.67,13.95 63.05,14.57 SWD.3
VBUS  (via drill 0.3 pad 0.61)  (1 unrouted)
  Top 0.254: v4.6,14.95 4.6,13.6 USB.1 | 3.95,13.52 3.92,13.49 3.87,13.49 3.87,15.06 4.08,15.27 4.96,15.27 5.13,15.09 5.13,13.46 4.91,13.69 4.91,14.98 4.79,15.09 4.2,15.09 4.04,14.93 4.04,13.74 4.07,13.72 4.74,13.72 4.74,14.89 4.69,14.94 4.29,14.94 4.27,14.92 4.27,13.91 4.4,13.91 4.4,14.87 4.31,14.96
  Bottom 0.254: D6.+ v4.6,14.95 4.6,19.05 | 4.6,19.05 4.6,22.6 J3.1 | 4.6,19.05 4.81,19.27 IC1.8 8.38,19.28 | 3.96,22.7 3.93,22.7 3.87,22.76 3.87,10.56 4.03,10.4 5.02,10.4 5.09,10.47 5.09,18.37 5.48,18.76 7.07,18.76 7.56,19.25 8.62,19.25 8.59,19.28 8.38,19.28 | 8.38,19.28 7.83,19.28 7.48,19.62 5.97,19.62 5.13,20.46 5.13,22.74 4.89,22.5 4.89,22.39
  Bottom 0.61: 4.89,22.39 4.86,22.36 4.86,20.23 5.73,19.36 7.25,19.36 6.93,19.03 4.94,19.03 4.97,19 4.97,18.57 4.98,18.59 4.98,19.79 4.2,20.57 4.2,22.42 4.16,22.38 4.16,10.77 4.87,11.48 4.75,11.6 4.75,18.29 4.75,18.3 | 4.75,18.3 4.75,18.32 | 4.45,19.79 4.45,18.13 4.62,18.3 4.75,18.3
VDD5V  (via drill 0.3 pad 0.61)
  Top 0.254: 54.03,12.7 U1.47
  Top 0.61: 54.03,12.7 56.42,12.7 57.84,14.12 v64.47,14.12
  Top 0.813: U1.47 50.82,12.73 45.91,7.82 8.51,7.82 v6.31,10.03
  Bottom 0.254: D6.- 4.8,8.71 | U4.3 6.96,10.68 v6.31,10.03 | v6.31,10.03 6.07,9.79 R7.1 | C31.1 3.42,7.92 4.06,8.56 | 6.33,8.25 6.33,8.27 6.32,8.27 | v6.31,10.03 6.36,10.03 6.36,10.02 | 6.88,10.02 6.94,10.02 6.97,10.06
  Bottom 0.61: v64.47,14.12 64.47,11.29 65.97,9.79 J7.9 J6.1 | 6.32,8.27 6.32,9.41 6.97,10.06 7.7,10.06 7.7,11.21 7.69,11.22 6.59,11.22 5.86,10.48 5.86,9.52 5.05,8.71 | 4,8.62 4.06,8.56 5.69,8.56 6.21,9.08 6.21,10.24 6.67,10.7 7.24,10.7 7.25,10.69 7.25,10.4 6.88,10.02 6.36,10.02 | 6.33,8.25 4.43,8.25 3.79,7.61 3.79,6.95 3.75,6.91 2.9,6.91 2.88,6.92 2.88,7.74 3.86,8.71 4.83,8.71 | 4.83,8.71 5.07,8.71 5.13,8.65 4.33,8.65 3.2,7.52 | 4.8,8.71 4.83,8.71
  Bottom 0.813: v6.31,10.03 6.07,9.79

### Text on the board
tNames: +3V3 | GND | SWDIO | SWDCLK | RESET
bNames: P0.23 | P0.12 | P1.09 | P0.07 | P0.05 | P0.04 | P0.31 | P0.30 | P0.29 | P0.28 | P0.02 | P0.03 | P1.15 | P1.13 | P1.11 | P1.10 | GND | P0.18 | GND | +3V3 | J1 | MakePython | P1.05 | P1.07 | P1.08 | P1.12 | P1.14 | P0.24 | GND | +3V3 | USB-UART | NRF52840 V1.1 | J4 | www.makerfabs.com | P0.21 | P0.16 | P0.13 | P0.14 | P0.15 | P0.17 | P0.20 | GND | 5V | J7 | P1.03 | P1.01 | P1.02 | P1.04 | P1.06 | P0.09 | P0.10 | GND | 5V | J6 | P0.19 | P0.22 | P1.00